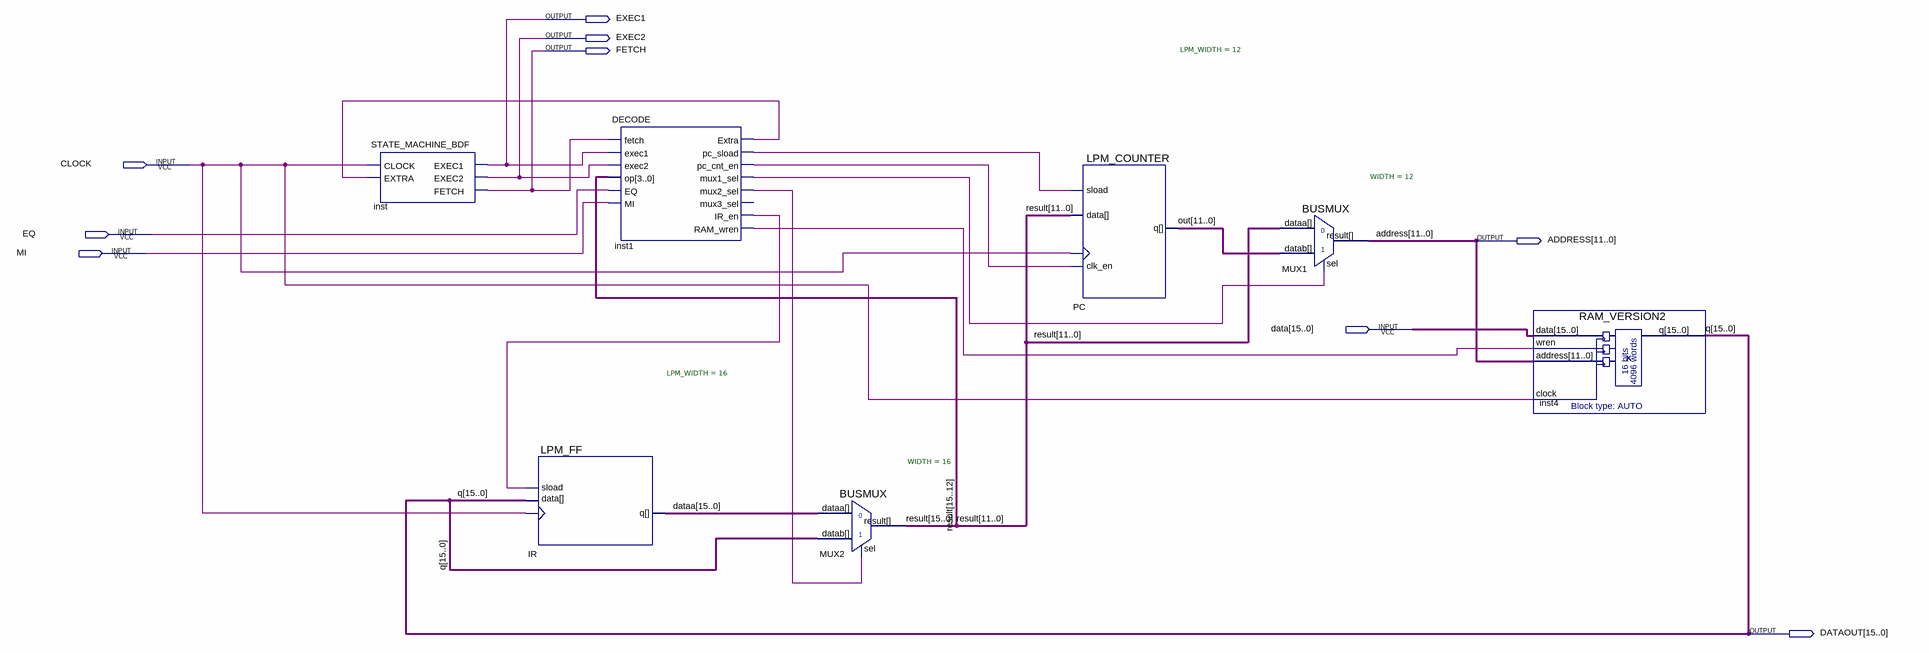
[diagram p0: schematic sheet]
// Quartus schematic TASK4_V2.bdf as structural Verilog: 7 symbols, 9 pins
module TASK4_V2 (
  input  CLOCK,
  input  EQ,
  input  MI,
  input  [15:0] data,
  output EXEC1,
  output EXEC2,
  output FETCH,
  output [11:0] ADDRESS,
  output [15:0] DATAOUT
);

  wire inst1_extra, inst1_ir_en, inst1_mux1_sel, inst1_mux2_sel, inst1_pc_cnt_en, inst1_pc_sload,
       inst1_ram_wren;
  wire [11:0] out;
  wire [15:0] dataa, result;

  STATE_MACHINE_BDF inst (.CLOCK(CLOCK), .EXTRA(inst1_extra), .EXEC1(EXEC1), .EXEC2(EXEC2), .FETCH(FETCH));
  LPM_FF #(.LPM_WIDTH(16)) IR (.clock(CLOCK), .data(DATAOUT), .sload(inst1_ir_en), .q(dataa));
  DECODE inst1 (
    .fetch(FETCH), .exec1(EXEC1), .exec2(EXEC2), .op(result[15:12]), .EQ(EQ), .MI(MI), .Extra(inst1_extra),
    .pc_sload(inst1_pc_sload), .pc_cnt_en(inst1_pc_cnt_en), .mux1_sel(inst1_mux1_sel),
    .mux2_sel(inst1_mux2_sel), .IR_en(inst1_ir_en), .RAM_wren(inst1_ram_wren));  // open: mux3_sel
  BUSMUX #(.WIDTH(16)) MUX2 (.datab(DATAOUT), .sel(inst1_mux2_sel), .dataa(dataa), .result(result));
  LPM_COUNTER #(.LPM_WIDTH(12)) PC (
    .clk_en(inst1_pc_cnt_en), .clock(CLOCK), .data(result[11:0]), .sload(inst1_pc_sload), .q(out));
  BUSMUX #(.WIDTH(12)) MUX1 (.datab(out), .sel(inst1_mux1_sel), .dataa(result[11:0]), .result(ADDRESS));
  RAM_VERSION2 inst4 (.data(data), .wren(inst1_ram_wren), .address(ADDRESS), .clock(CLOCK), .q(DATAOUT));

  // Other names for the same wires on the sheet: q[15:0] = DATAOUT
endmodule
